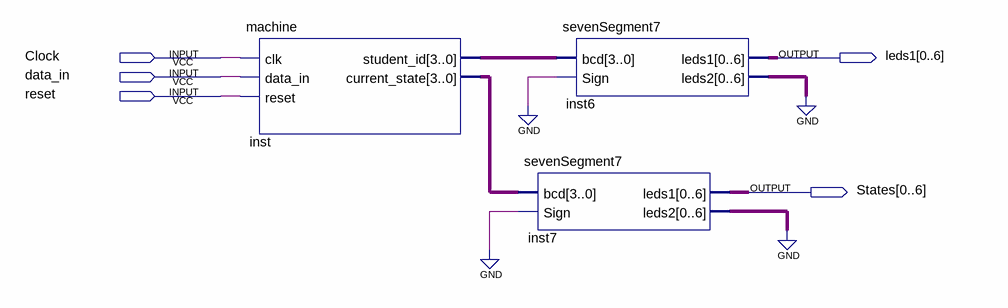
[diagram p0: schematic sheet]
// Quartus schematic lab5.bdf as structural Verilog: 3 symbols, 5 pins
module lab5 (
  input  Clock,
  input  data_in,
  input  reset,
  output [0:6] leds1,
  output [0:6] States
);

  wire [3:0] inst_current_state, inst_student_id;
  wire [6:0] inst6_leds2, inst7_leds2;

  machine inst (
    .clk(Clock), .data_in(data_in), .reset(reset), .student_id(inst_student_id),
    .current_state(inst_current_state));
  sevenSegment7 inst7 (.bcd(inst_current_state), .Sign(1'b0), .leds1(States), .leds2(inst7_leds2));
  sevenSegment7 inst6 (.bcd(inst_student_id), .Sign(1'b0), .leds1(leds1), .leds2(inst6_leds2));
  // also tied to GND on the sheet: {inst6_leds2[0], inst6_leds2[1], inst6_leds2[2], inst6_leds2[3], inst6_leds2[4], inst6_leds2[5], inst6_leds2[6], inst7_leds2[0], inst7_leds2[1], inst7_leds2[2], inst7_leds2[3], inst7_leds2[4], inst7_leds2[5], inst7_leds2[6]}
endmodule
